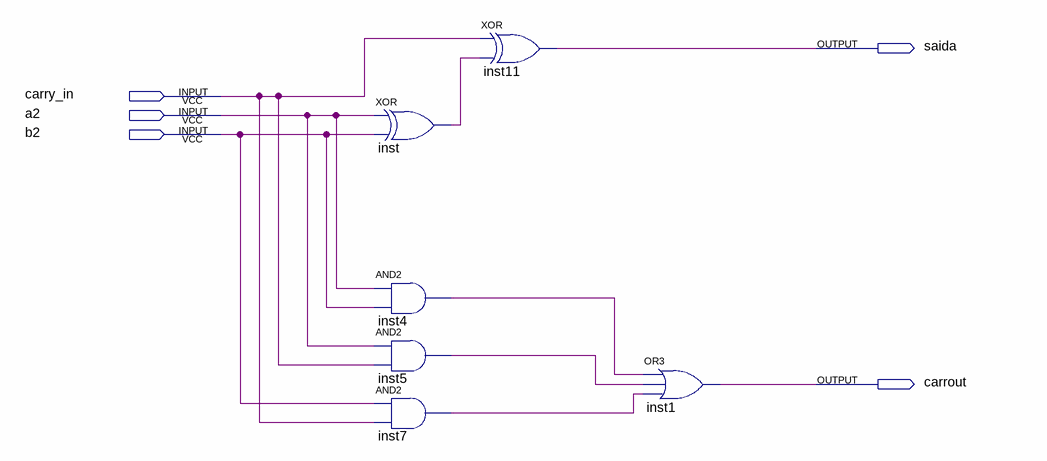
[diagram p0: schematic sheet]
// Quartus schematic SomadorCompleto.bdf as structural Verilog: 6 symbols, 5 pins
module SomadorCompleto (
  input  carry_in,
  input  a2,
  input  b2,
  output saida,
  output carrout
);

  wire inst4_out, inst5_out, inst7_out, inst_out;

  xor inst (inst_out, a2, b2);
  and inst4 (inst4_out, a2, b2);
  and inst5 (inst5_out, a2, carry_in);
  and inst7 (inst7_out, b2, carry_in);
  xor inst11 (saida, carry_in, inst_out);
  or inst1 (carrout, inst4_out, inst5_out, inst7_out);
endmodule
